# EAGLE design SPS_V2-5 (EAGLE 7.5.0)
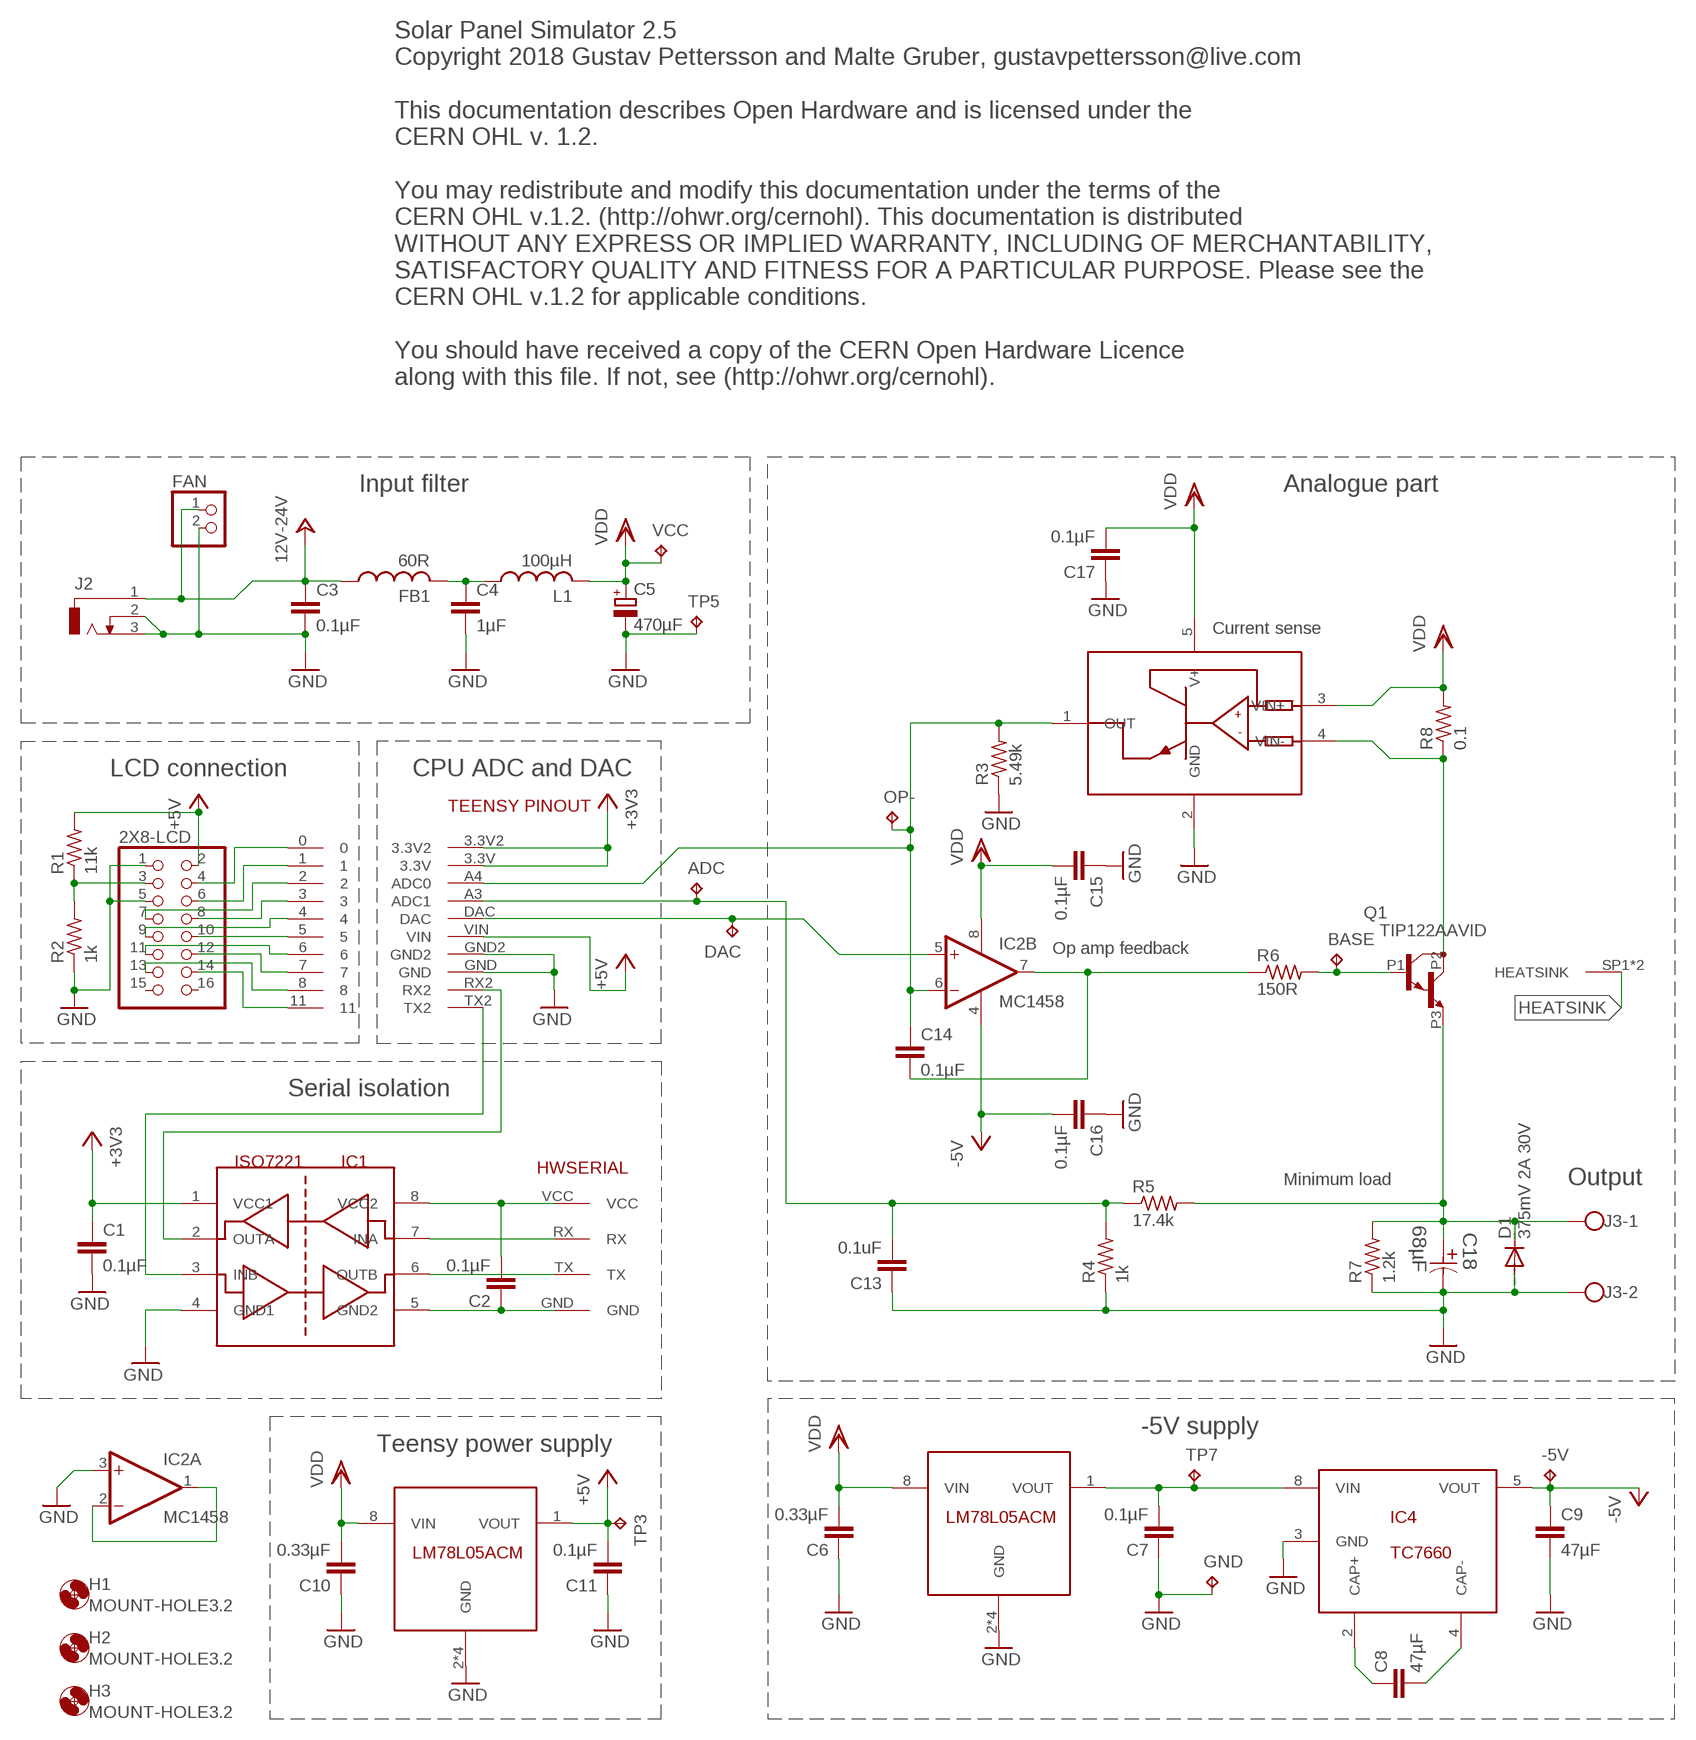
[diagram p0: schematic, sheet 1]

## Parts
2X8-LCD  PINHD-2X8  [2X08]
-5V  TPTP10R  [TP10R]
ADC  TPTP10R  [TP10R]
BASE  TPTP10R  [TP10R]
C1  0.1µF  C-EUC0603  [C0603]
C2  0.1µF  C-EUC0603  [C0603]
C3  0.1µF  C-EUC0603  [C0603]
C4  1µF  C-EUC0603  [C0603]
C5  470µF  12.5CAP  [12.5MMSMD]
C6  0.33µF  C-EUC0603  [C0603]
C7  0.1µF  C-EUC0603  [C0603]
C8  47µF  C-EUC1206  [C1206]
C9  47µF  C-EUC1206  [C1206]
C10  0.33µF  C-EUC0603  [C0603]
C11  0.1µF  C-EUC0603  [C0603]
C13  0.1uF  C-EUC0603  [C0603]
C14  0.1µF  C-EUC0603  [C0603]
C15  0.1µF  C-EUC0603  [C0603]
C16  0.1µF  C-EUC0603  [C0603]
C17  0.1µF  C-EUC0603  [C0603]
C18  68µF  EEE-FPV680XAP-CASE-D8  [CAPAE660X800N]
D1  375mV 2A 30V  DIODE-DO214AC  [DO214AC]
DAC  TPTP10R  [TP10R]
DB1  TEENSY3.2  [TEENSY3.2]
FAN  PINHD-1X2  [1X02]
FB1  60R  1206FERRITEBEAD  [R1206]
GND  TPTP10R  [TP10R]
H1  MOUNT-HOLE3.2  [3,2]
H2  MOUNT-HOLE3.2  [3,2]
H3  MOUNT-HOLE3.2  [3,2]
IC1  ISO7221  [SO8]
IC2  MC1458  LM4558D  [SO08]
IC3  LM78L05ACM  [SO8]
IC4  TC7660  TL7660  [SO8]
IC5  LM78L05ACM  [SO8]
IC6  INA139  [SOT23-5L]
J1  HWSERIAL  [HWSERIAL]
J2  DCJ0303  [DCJ0303]
J3  W237-102  [W237-102]
L1  100µH  1210INDUCTOR  [1210INDUCTOR]
OP-  TPTP10R  [TP10R]
Q1  TIP122AAVID  [OP-220-AAVID]
R1  11k  R-US_R0603  [R0603]
R2  1k  R-US_R0603  [R0603]
R3  5.49k  R-US_R0603  [R0603]
R4  1k  R-US_R0603  [R0603]
R5  17.4k  R-US_R0603  [R0603]
R6  150R  R-US_R0603  [R0603]
R7  1.2k  R-US_R1206  [R1206]
R8  0.1  R-US_R1206  [R1206]
TP3  TPTP10R  [TP10R]
TP5  TPTP10R  [TP10R]
TP7  TPTP10R  [TP10R]
VCC  TPTP10R  [TP10R]

## Nets
+3V3: C1.1 DB1.3.3V DB1.3.3V2 IC1.1(VCC1)
+5V: 2X8-LCD.2 C11.2 DB1.VIN IC5.1(VOUT) R1.2 TP3.TP
+24V: C3.1 FAN.1 FB1.1 J2.1 ; supply symbol labelled 12V-24V
-5V: -5V.TP C9.1 C16.2 IC2.4(P:V-) IC4.5(VOUT)
GND: 2X8-LCD.1 2X8-LCD.5 C1.2 C3.2 C4.2 C5.P$1(-) C6.1 C7.1 C9.2 C10.1 C11.1 C13.1 C15.1 C16.1 C17.1 C18.2 D1.A DB1.GND DB1.GND2 FAN.2 GND.TP IC1.4(GND1) IC2.3(A:+IN) IC3.2(GND) IC3.3(GND) IC3.6(GND) IC3.7(GND) IC4.3(GND) IC5.2(GND) IC5.3(GND) IC5.6(GND) IC5.7(GND) IC6.2(GND) J2.2 J2.3 J3.2 R2.1 R3.1 R4.1 R7.1 TP5.TP
HEATSINK: Q1.SP1(HEATSINK) Q1.SP2(HEATSINK)
N$1: C14.2 IC2.7(B:OUT) R6.1
N$2: BASE.TP Q1.P1(B) R6.2
N$3: C4.1 FB1.2 L1.P$1
N$4: C14.1 DB1.A4(ADC0) IC2.6(B:-IN) IC6.1(OUT) OP-.TP R3.2
N$6: C2.2 IC1.8(VCC2) J1.VCC
N$7: ADC.TP C13.2 DB1.A3(ADC1) R4.2 R5.1
N$8: IC1.7(INA) J1.RX
N$9: DAC.TP DB1.DAC IC2.5(B:+IN)
N$10: 2X8-LCD.4 DB1.0
N$11: IC6.4(VIN-) Q1.P2(C) R8.1
N$13: IC1.6(OUTB) J1.TX
N$14: C8.2 IC4.4(CAP-)
N$16: C8.1 IC4.2(CAP+)
N$17: DB1.RX2 IC1.2(OUTA)
N$18: DB1.TX2 IC1.3(INB)
N$19: C2.1 IC1.5(GND2) J1.GND
N$22: C7.2 IC3.1(VOUT) IC4.8(VIN) TP7.TP
N$23: 2X8-LCD.6 DB1.1
N$25: 2X8-LCD.7 DB1.2
N$26: 2X8-LCD.8 DB1.3
N$27: 2X8-LCD.9 DB1.4
N$28: 2X8-LCD.10 DB1.5
N$29: 2X8-LCD.11 DB1.6
N$30: 2X8-LCD.12 DB1.7
N$31: 2X8-LCD.13 DB1.8
N$32: 2X8-LCD.14 DB1.11
N$33: 2X8-LCD.3 R1.1 R2.2
N$41X: IC2.1(A:OUT) IC2.2(A:-IN)
N$46: C18.1 D1.C J3.1 Q1.P3(E) R5.2 R7.2
VDD: C5.P$2(+) C6.2 C10.2 C15.2 C17.2 IC2.8(P:V+) IC3.8(VIN) IC5.8(VIN) IC6.3(VIN+) IC6.5(V+) L1.P$2 R8.2 VCC.TP
Unconnected: 2X8-LCD.15 2X8-LCD.16

## Notes on the sheet
- Solar Panel Simulator 2.5
  Copyright 2018 Gustav Pettersson and Malte Gruber, gustavpettersson@live.com
  
  This documentation describes Open Hardware and is licensed under the
  CERN OHL v. 1.2.
  
  You may redistribute and modify this documentation under the terms of the
  CERN OHL v.1.2. (http://ohwr.org/cernohl). This documentation is distributed
  WITHOUT ANY EXPRESS OR IMPLIED WARRANTY, INCLUDING OF MERCHANTABILITY, 
  SATISFACTORY QUALITY AND FITNESS FOR A PARTICULAR PURPOSE. Please see the 
  CERN OHL v.1.2 for applicable conditions.
  
  You should have received a copy of the CERN Open Hardware Licence
  along with this file. If not, see (http://ohwr.org/cernohl).
- Input filter | Analogue part
- Current sense
- LCD connection | CPU ADC and DAC
- Op amp feedback
- Serial isolation
- Minimum load | Output
- -5V supply
- Teensy power supply

## Library data of the parts
2X8-LCD = pinhead:PINHD-2X8: PIN HEADER
-5V ADC BASE DAC GND OP- TP3 TP5 TP7 VCC = testpad:TP: Test pad
C1-C4 C6 C7 C10 C11 C13-C17 = rcl:C-EU: CAPACITOR, European symbol
C5 = Homemade:12.5CAP
C8 C9 = resistor:C-EU: CAPACITOR, European symbol
C18 = 1MIST_CAPACITR_Panasonic-EEEFK_EEEFP:EEE-: Aluminum Electrolytic Capacitors,Surface Mount Type; MPN: EEE-FPV680XAP; OC_FARNELL: 1539500; OC_NEWARK: 94M7005; PACKAGE: CASE-D8; SUPPLIER: PANASONIC; TOLERANCE: ±20 %; VALUE: 68UF; VOLTAGERATING: 35V
D1 = diode:DIODE-: DIODE
DB1 = Homemade:TEENSY3.2
FAN = pinhead:PINHD-1X2: PIN HEADER
FB1 = Homemade:1206FERRITEBEAD
H1-H3 = holes:MOUNT-HOLE: MOUNTING HOLE with drill center marker
IC1 = Homemade:ISO7221
IC2 = linear:*4558: OP AMP
IC3 IC5 = Homemade:LM78L05ACM
IC4 = Homemade:TL7660
IC6 = Homemade:INA139
J1 = Homemade:HWSERIAL
J2 = con-jack:DCJ0303: DC POWER JACK Source: DCJ0303.pdf; OC_FARNELL: unknown; OC_NEWARK: unknown
J3 = con-wago-500:W237-102: WAGO SCREW CLAMP; MPN: 237-102; OC_FARNELL: unknown; OC_NEWARK: 70K9898
L1 = Homemade:1210INDUCTOR
Q1 = Homemade:TIP122AAVID
R1-R8 = rcl:R-US_: RESISTOR, American symbol

## Board
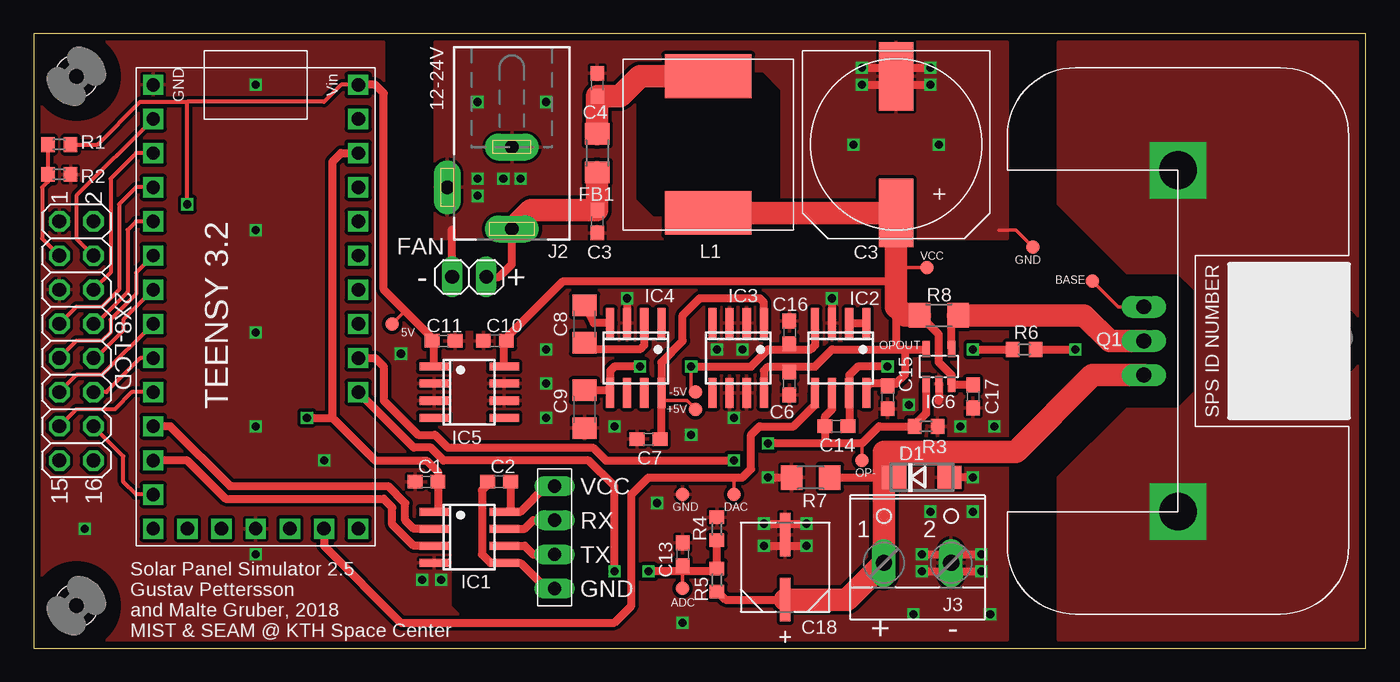
[diagram p1: board, top side]
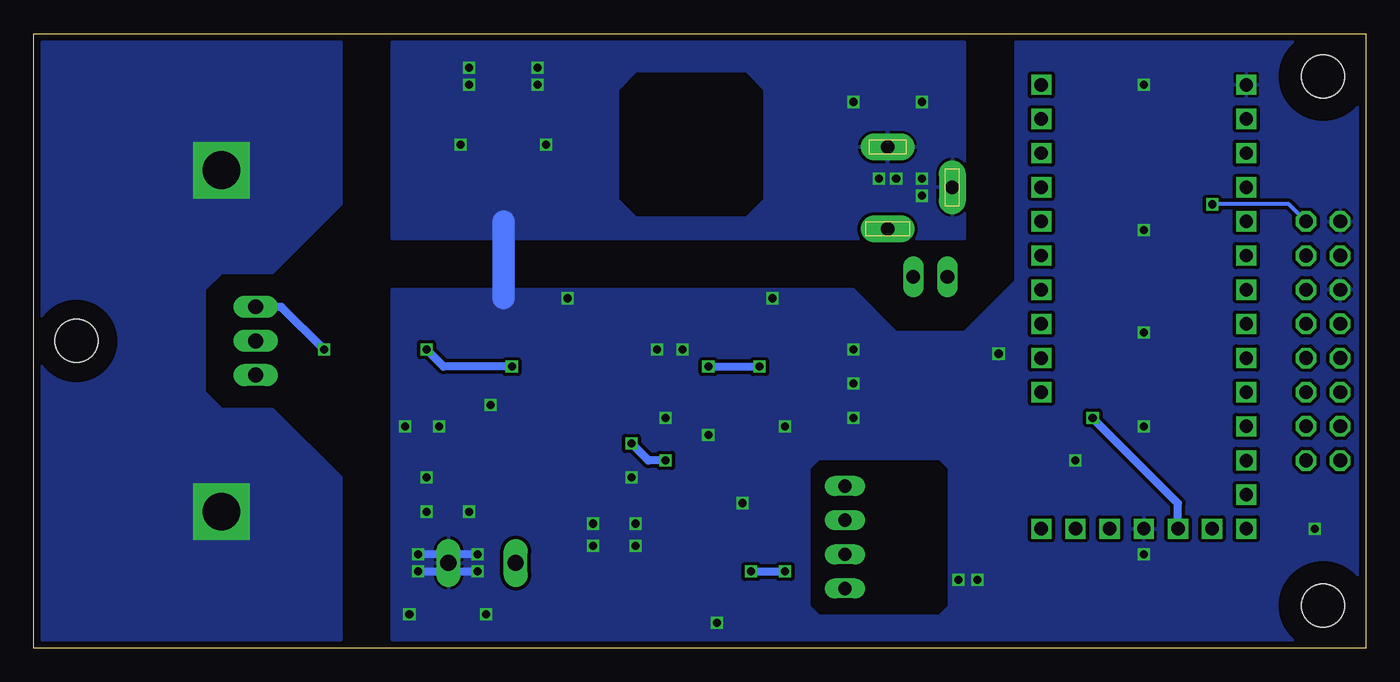
[diagram p2: board, bottom side, seen from below]

Size 99.06 x 45.72 mm. Coordinates in mm from the lower left corner, seen from the top.
Outline: 0,45.72 0,0 99.06,0 99.06,45.72 0,45.72
Copper layers (1*16): Top 0.018mm / dielectric 1.55mm / Bottom 0.018mm
Design rules "eC_2Layer_PClass6_BaseCopperO18_eCDefault *": minimum track width 0.15mm, minimum drill 0.35mm, track to track 0.15mm, track to pad 0.15mm, pad to pad 0.15mm, via to via 0.15mm, smd to smd 0mil, copper to edge 0.25mm, drill to drill 0.35mm, minimum pad ring 0.175mm, minimum via ring 0.125mm, stop-mask expansion 0mil, vias tented up to drill 0.45mm, thermal gap 0.2mm

### Footprints (pad centres in the part's own frame; a part is rotated, then mirrored left to right if it is on the bottom)
2X08 = drill 1.016 octagon: 1 -8.89,-1.27; 2 -8.89,1.27; 3 -6.35,-1.27; 4 -6.35,1.27; 5 -3.81,-1.27; 6 -3.81,1.27; 7 -1.27,-1.27; 8 -1.27,1.27; 9 1.27,-1.27; 10 1.27,1.27; 11 3.81,-1.27; 12 3.81,1.27; 13 6.35,-1.27; 14 6.35,1.27; 15 8.89,-1.27; 16 8.89,1.27
TP10R = smd 1 x 1: TP 0,0
C0603 = smd 1.1 x 1: 1 -0.85,0; 2 0.85,0
12.5MMSMD = smd 5.08 x 2.54: P$1 -5.08,0; P$2 5.08,0
C1206 = smd 1.6 x 1.8: 1 -1.4,0; 2 1.4,0
CAPAE660X800N = smd 3.251 x 0.762: 1 -2.413,0; 2 2.413,0
DO214AC = smd 1.8 x 1.7: A 2.05,0; C -2.05,0
TEENSY3.2 = drill 1 square: 0 -13.97,-7.62; 1 -11.43,-7.62; 2 -8.89,-7.62; 3 -6.35,-7.62; 3.3V 16.51,-2.54; 3.3V2 -11.43,7.62; 4 -3.81,-7.62; 5 -1.27,-7.62; 6 1.27,-7.62; 7 3.81,-7.62; 8 6.35,-7.62; 11 13.97,-7.62; 12 16.51,-7.62; 13 16.51,7.62; A3 6.35,7.62; A4 3.81,7.62; A5 1.27,7.62; A6 -1.27,7.62; A7 -3.81,7.62; A8 -6.35,7.62; A9 -8.89,7.62; AGND -13.97,7.62; DAC 16.51,5.08; GND -16.51,-7.62; GND2 16.51,0; PROGRAM 16.51,2.54; RX2 8.89,-7.62; TX2 11.43,-7.62; VBAT 16.51,-5.08; VIN -16.51,7.62
1X02 = drill 1.016 long: 1 -1.27,0; 2 1.27,0
R1206 = smd 1.6 x 1.803: 1 -1.422,0; 2 1.422,0
3,2 = hole 3.2: 0,0
SO8 = smd 0.6 x 2.2: 1 -1.905,-2.6; 2 -0.635,-2.6; 3 0.635,-2.6; 4 1.905,-2.6; 5 1.905,2.6; 6 0.635,2.6; 7 -0.635,2.6; 8 -1.905,2.6
SO08 = smd 0.6 x 2.2: 1 -1.905,-2.6; 2 -0.635,-2.6; 3 0.635,-2.6; 4 1.905,-2.6; 5 1.905,2.6; 6 0.635,2.6; 7 -0.635,2.6; 8 -1.905,2.6
SOT23-5L = smd 0.55 x 1.2: 1 -0.95,-1.3; 2 0,-1.3; 3 0.95,-1.3; 4 0.95,1.3; 5 -0.95,1.3
HWSERIAL = drill 1 long: GND 0,-3.81; RX 0,1.27; TX 0,-1.27; VCC 0,3.81
DCJ0303 = drill 1 pad 2 long: 1 0,3.1; 2 4.8,0; 3 0,-3
W237-102 = drill 1.194 long: 1 -2.5,-1.27; 2 2.5,-1.27
1210INDUCTOR = smd 6.452 x 3.251: P$1 0,5.08; P$2 0,-5.08
OP-220-AAVID = drill 1.1 long: P1 -2.54,-2.54; P2 0,-2.54; P3 2.54,-2.54 | drill 2.8 square: SP1 -12.7,0; SP2 12.7,0
R0603 = smd 1 x 1.1: 1 -0.85,0; 2 0.85,0

### Placement (x,y rotation side)
2X8-LCD  3.17,22.86 270 top
-5V  49.21,19.05 0 top
ADC  48.26,4.45 0 top
BASE  78.74,27.3 0 top
C1  29.21,12.38 180 top
C2  34.61,12.38 0 top
C3  41.91,31.75 270 top
C4  41.91,41.91 90 top
C5  64.14,37.47 270 top
C6  56.2,19.68 90 top
C7  45.72,15.56 0 top
C8  40.96,24.13 90 top
C9  40.96,17.78 270 top
C10  34.29,22.86 0 top
C11  30.48,22.86 180 top
C13  48.26,6.99 270 top
C14  59.69,16.51 0 top
C15  63.5,18.67 90 top
C16  56.2,23.5 270 top
C17  69.85,18.73 90 top
C18  55.88,6.03 90 top
D1  66.04,12.7 0 top
DAC  52.07,11.43 0 top
DB1  16.51,25.4 270 top
FAN  32.38,27.62 180 top
FB1  41.91,36.83 90 top
GND  48.26,11.43 0 top
H1  3.17,3.17 0 top
H2  3.17,42.55 0 top
H3  95.89,22.86 0 top
IC1  32.38,8.26 270 top
IC2  60.01,21.59 180 top
IC3  52.39,21.59 180 top
IC4  44.77,21.59 180 top
IC5  32.38,19.05 270 top
IC6  67.31,20.95 0 top
J1  38.73,8.26 0 top
J2  35.56,34.29 180 top
J3  65.72,7.62 0 top
L1  50.16,37.47 0 top
OP-  61.59,13.97 0 top
Q1  85.09,22.86 270 top
R1  1.91,37.47 0 top
R2  1.91,35.24 180 top
R3  66.36,16.51 180 top
R4  50.8,8.89 270 top
R5  50.8,5.08 270 top
R6  73.66,22.23 0 top
R7  57.78,12.7 0 top
R8  67.31,24.77 180 top
TP3  26.67,24.13 0 top
TP5  74.3,29.84 0 top
TP7  49.21,17.78 0 top
VCC  66.42,28.32 0 top

### Tracks (layer width: path | path; a pad name or v marks a point on that pad's centre or on a via)
+3V3  (via drill 0.6)
  Top 0.61: 29.74,10.16 IC1.1 30.06,10.16 C1.1 30.06,13.12 29.21,13.97 25.4,13.97 22.23,17.14 | 22.23,17.14 22.23,36.2 22.86,36.83 DB1.3.3V2 | v20.32,17.14 22.23,17.14
  Bottom 0.61: DB1.3.3V 13.97,10.79 v20.32,17.14
+5V  (via drill 0.6)
  Top 0.254: TP3.TP 27.62,25.08
  Top 0.305: DB1.VIN 22.86,41.91 21.59,40.64 11.43,40.64 | v11.43,33.02 11.43,40.64 | R1.2 4.76,37.47 7.94,40.64 11.43,40.64
  Top 0.61: IC5.1 29.79,22.7 C11.2 29.63,23.07 27.62,25.08 26.04,26.67 26.04,41.27 25.4,41.91 DB1.VIN
  Bottom 0.305: 2X8-LCD.2 5.71,33.02 v11.43,33.02
+24V
  Top 0.61: FAN.1 34.61,27.62 35.56,28.57 J2.1
  Top 1.676: FB1.1 C3.1 36.97,32.6 J2.1
-5V  (via drill 0.6)
  Top 0.254: -5V.TP 48.9,19.37 v48.9,20.95
  Top 0.61: IC2.4 58.1,22.54 57.78,22.23 56.2,22.23 | v48.9,20.95 53.34,20.95 54.61,22.23 56.2,22.23 | v45.09,20.95 43.18,20.95 42.86,20.64 IC4.5 42.67,19.18 C9.1 | C16.2 56.2,22.23
  Bottom 0.61: v48.9,20.95 v45.09,20.95
GND  (via drill 0.6)
  Top 0.254: TP5.TP 73.03,31.11 71.75,31.11
  Top 0.61: v54.61,12.7 R7.1 | v54.29,9.27 v57.47,9.27 | v54.29,7.62 v57.47,7.62 | v66.04,6.99 v70.48,6.99 | v66.04,5.71 v70.48,5.71 | v69.85,12.7 67.94,12.7 | v61.59,43.18 v66.67,43.18 | v61.59,41.91 v66.67,41.91 | FAN.2 31.11,31.11 | v44.13,26.04 44.13,24.13 | v59.37,26.04 59.37,24.13 | 67.31,19.68 67.31,18.41
  Bottom 0.61: v66.04,6.99 v70.48,6.99 | v70.48,5.71 v66.04,5.71
  Bottom 1.676: 64.14,31.75 64.14,26.04
  other vias: 48.26,1.91 33.02,33.66 33.02,34.92 34.92,34.92 36.2,34.92 46.35,10.79 65.41,2.54 71.12,2.54 69.85,10.16 66.67,10.16 33.02,40.64 38.1,40.64 60.96,37.47 67.31,37.47 68.9,16.51 71.44,16.51 16.51,31.11 30.29,5.08 28.89,5.08 65.09,18.1 52.7,22.23 50.8,22.23 27.3,21.91 38.1,19.68 38.1,17.14 48.9,15.88 52.07,17.14 16.51,41.91 16.51,23.5 16.51,16.51 16.51,6.99 43.18,16.51 3.81,8.89 21.59,13.97 38.1,22.23
  pour Top (isolate 0.254): 72.39,0.64 0.64,0.64 0.64,45.09 26.04,45.09 26.04,27.3 29.84,23.5 34.92,23.5 38.1,26.67 72.39,26.67
  pour Top (isolate 0.254): 29.84,45.09 72.39,45.09 72.39,30.48 29.84,30.48
  pour Bottom (isolate 0.254): 29.84,45.09 72.39,45.09 72.39,30.48 64.77,30.48 64.77,26.67 72.39,26.67 72.39,0.64 0.64,0.64 0.64,45.09 26.04,45.09 26.04,27.3 29.84,23.5 34.92,23.5 38.1,26.67 63.5,26.67 63.5,30.48 29.84,30.48
HEATSINK
  pour Bottom (no thermals): 76.2,0.64 76.2,12.7 81.28,17.78 85.09,17.78 86.36,19.05 86.36,26.67 85.09,27.94 81.28,27.94 76.2,33.02 76.2,45.09 98.42,45.09 98.42,0.64
  pour Top (no thermals): 76.2,0.64 76.2,12.7 81.28,17.78 85.09,17.78 86.36,19.05 86.36,26.67 85.09,27.94 81.28,27.94 76.2,33.02 76.2,45.09 98.42,45.09 98.42,0.64
N$1  (via drill 0.6)
  Top 0.61: v69.85,22.23 R6.1 | v63.5,20.95 61.28,20.95 60.64,20.32 IC2.7 60.64,16.61 C14.2
  Bottom 0.61: v63.5,20.95 68.58,20.95 v69.85,22.23
N$2  (via drill 0.6)
  Top 0.254: Q1.P1 80.64,25.4 BASE.TP
  Top 0.61: R6.2 v77.47,22.23
  Bottom 0.61: v77.47,22.23 80.64,25.4 Q1.P1
N$3
  Top 1.676: FB1.2 C4.1 43.6,41.06 45.09,42.55 L1.P$1
N$4  (via drill 0.6)
  Top 0.254: OP-.TP 61.59,15.24
  Top 0.61: 65.72,16.51 R3.2 | IC6.1 66.36,17.46 65.83,16.93 R3.2 | R3.2 62.87,16.51 61.59,15.24 58.74,15.24 | DB1.A4 25.4,21.59 26.04,20.95 26.04,18.41 28.57,15.88 29.84,15.88 30.8,14.92 41.59,14.92 42.55,13.97 v52.07,13.97 | IC2.6 59.37,17.78 58.84,17.25 C14.1 58.84,15.34 58.74,15.24 | 58.74,15.24 v54.61,15.24
  Bottom 0.61: v52.07,13.97 53.34,13.97 v54.61,15.24
N$5
  cutout Top: 54.23,42.8 53.59,42.8 53.59,40.64 46.61,40.64 46.61,41.53 45.59,41.53 44.83,40.77 44.83,33.4 46.1,32.13 46.74,32.13 46.74,34.29 53.72,34.29 53.72,33.4 55.5,33.4 55.5,41.53
N$6
  Top 0.61: 35.24,10.16 36.2,10.16 38.1,12.06 J1.VCC | C2.2 35.46,10.38 35.24,10.16 | 35.24,10.16 IC1.8
N$7  (via drill 0.6)
  Top 0.254: ADC.TP C13.2
  Top 0.61: R4.2 R5.1 50.59,5.71 48.26,5.71 | v43.18,5.71 43.18,12.06 41.27,13.97 30.48,13.97 29.53,14.92 28.26,14.92 DB1.A3 | 48.26,5.71 v45.72,5.71 | C13.2 48.26,5.71
  Bottom 0.61: v45.72,5.71 v43.18,5.71
N$8
  Top 0.61: IC1.7 36.51,8.89 37.15,9.53 J1.RX
N$9
  Top 0.254: DAC.TP 52.07,12.7
  Top 0.61: IC2.5 58.1,18.1 56.52,16.51 53.98,16.51 53.34,15.88 53.34,13.34 52.7,12.7 52.07,12.7 45.72,12.7 44.45,11.43 44.45,3.17 43.18,1.91 27.3,1.91 21.59,7.62 DB1.DAC
N$10
  Top 0.305: DB1.0 3.17,33.66 3.17,30.48 2X8-LCD.4
N$11
  Top 0.61: R8.1 68.26,24.29 IC6.4
  Top 1.676: R8.1 78.11,24.77 80.01,22.86 Q1.P2
N$12
  cutout Bottom: 54.23,42.8 46.1,42.8 44.83,41.53 44.83,33.4 46.1,32.13 54.23,32.13 55.5,33.4 55.5,41.53
N$13
  Top 0.61: IC1.6 36.51,7.62 37.15,6.99 J1.TX
N$14
  Top 0.61: IC4.4 41.66,24.19 C8.2
N$16
  Top 0.61: IC4.2 45.4,22.54 45.09,22.23 41.09,22.23 C8.1
N$17
  Top 0.61: IC1.2 28.26,8.89 27.62,9.53 27.62,10.79 26.35,12.06 14.61,12.06 10.16,16.51 DB1.RX2
N$18
  Top 0.61: IC1.3 28.26,7.62 26.67,9.21 26.67,10.48 26.04,11.11 14.29,11.11 11.43,13.97 DB1.TX2
N$19
  Top 0.61: C2.1 33.76,12.17 33.34,11.75 33.34,6.99 33.97,6.35 IC1.5 36.2,6.35 38.1,4.45 J1.GND
N$20
  cutout Top: 31.75,13.97 31.11,13.34 31.11,3.17 31.75,2.54 40.64,2.54 41.27,3.17 41.27,13.34 40.64,13.97
N$21
  cutout Bottom: 31.75,13.97 31.11,13.34 31.11,3.17 31.75,2.54 40.64,2.54 41.27,3.17 41.27,13.34 40.64,13.97
N$22
  Top 0.254: TP7.TP 48.58,18.41 46.67,18.41
  Top 0.61: IC3.1 54.29,25.72 53.98,26.04 49.53,26.04 48.26,24.77 48.26,22.86 46.67,21.27 IC4.8 46.67,18.41 46.67,15.66 C7.2
N$23
  Top 0.305: DB1.1 7.62,36.83 5.71,34.92 5.71,27.94 2X8-LCD.6
N$25
  Top 0.305: DB1.2 7.62,34.29 6.35,33.02 6.35,26.67 5.08,25.4 3.17,25.4 2X8-LCD.7
N$26
  Top 0.305: DB1.3 7.62,31.75 6.99,31.11 6.99,26.51 4.6,24.13 2X8-LCD.8
N$27
  Top 0.305: DB1.4 7.62,27.94 7.62,26.35 5.71,24.45 5.71,23.5 5.08,22.86 3.17,22.86 2X8-LCD.9
N$28
  Top 0.305: DB1.5 6.67,24.45 6.67,23.65 4.6,21.59 2X8-LCD.10
N$29
  Top 0.305: DB1.6 5.08,20.32 3.17,20.32 2X8-LCD.11
N$30
  Top 0.305: DB1.7 7.94,21.59 5.4,19.05 2X8-LCD.12
N$31
  Top 0.305: DB1.8 7.3,19.05 6.03,17.78 3.17,17.78 2X8-LCD.13
N$32
  Top 0.305: DB1.11 7.62,11.43 6.67,12.38 6.67,14.29 2X8-LCD.14
N$33
  Top 0.305: 2X8-LCD.3 0.64,30.48 0.64,34.29 1.05,34.71 R2.2 R1.1
N$41X
  Top 0.61: IC2.2 IC2.1
N$46
  Top 0.61: D1.C 63.22,12.7 R7.2 | R5.2 51.46,3.62 C18.1
  Top 1.676: Q1.P3 78.74,20.32 73.03,14.61 63.22,14.61 63.22,12.7 J3.1 60.49,3.62 C18.1
VDD
  Top 0.254: VCC.TP 64.26,28.32
  Top 0.61: 66.36,24.29 R8.2 67.31,23.34 67.31,21.27 68.26,20.32 IC6.3 68.26,19.58 C17.2 | 64.26,28.32 64.14,28.19 | 55.88,20.95 54.61,20.95 54.29,20.64 IC3.8 | 55.88,20.95 58.1,20.95 59.37,22.23 64.14,22.23 | IC2.8 61.91,19.37 62.23,19.68 63.98,19.68 | C6.2 55.88,20.85 55.88,20.95 | 64.14,22.23 64.14,24.77 64.45,24.77 64.45,25.08 | 64.14,22.23 64.77,22.23 | 64.77,22.23 66.33,22.23 IC6.5 | 64.77,22.23 64.77,20.32 64.14,19.68 63.98,19.68 | C15.2 63.98,19.68 | 64.14,27.3 39.37,27.3 35.14,23.07 C10.2 34.98,22.7 IC5.8
  Top 1.676: L1.P$2 C5.P$2 64.14,28.19 64.14,27.3 64.14,25.4 64.45,25.08 64.77,24.77 R8.2

### Text on the board
tPlace: - | + | 5V | OPOUT | + | -
tNames: 12-24V | C3 | GND | SPS ID NUMBER | Q1 | +5V | Solar Panel Simulator 2.5 / Gustav Pettersson / and Malte Gruber, 2018 / MIST & SEAM @ KTH Space Center
Document: Solar Panel Simulator 2.5 / Copyright 2018 Gustav Pettersson and Malte Gruber, gustavpettersson@live.com / / This documentation describes Open Hardware and is licensed under the / CERN OHL v. 1.2. / / You may redistribute and modify this documentation under the terms of the / CERN OHL v.1.2. (http://ohwr.org/cernohl). This documentation is distributed / WITHOUT ANY EXPRESS OR IMPLIED WARRANTY, INCLUDING OF MERCHANTABILITY, / SATISFACTORY QUALITY AND FITNESS FOR A PARTICULAR PURPOSE. Please see the / CERN OHL v.1.2 for applicable conditions. / / You should have received a copy of the CERN Open Hardware Licence / along with this file. If not, see (http://ohwr.org/cernohl).